# Altium schematic sheet LED.SchDoc
size A; SheetNumber: 10
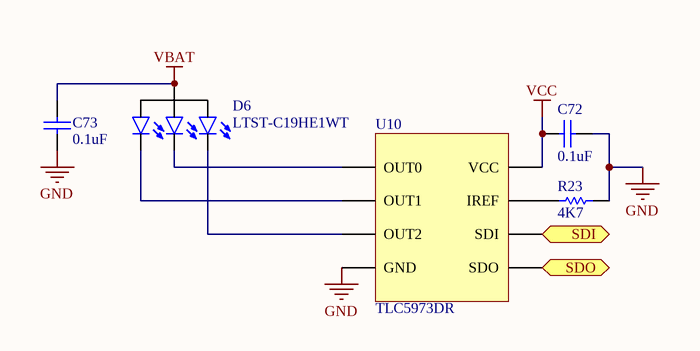
[diagram p0: LED.SchDoc]

## Parts
C72  value 0.1uF  [C0402[1005X55]]  (hidden comment: 0.1uF 6.3V 0402)
C73  value 0.1uF  [C0402[1005X55]]  (hidden comment: 0.1uF 6.3V 0402)
D6  LTST-C19HE1WT  [LED0606]
R23  value 4K7  [R0402[1005]]  (hidden comment: 4K7 1% 0402)
U10  TLC5973DR  [SOIC-8]

## Ports
SDI (in), SDO (out)

## Nets
GND: C72.2 C73.1 R23.1 U10.4(GND)
VBAT: C73.2 D6.4(A)
VCC: C72.1 U10.8(VCC)
SDI: U10.6(SDI) ; port SDI
SDO: U10.5(SDO) ; port SDO
NetD6_1: D6.1(K_Red) U10.3(OUT2)
NetD6_2: D6.2(K_Green) U10.1(OUT0)
NetD6_3: D6.3(K_Blue) U10.2(OUT1)
NetR23_2: R23.2 U10.7(IREF)

## Library data of the parts
C72 C73 = CAP_0.1uF_6.3V_0402_10%: 0.1uF 6.3V 10% 0402 (1005 Metric); PartNumber: GRM155R70J104KA01D; Manufacturer: Murata; Mounting Technology: Surface Mount; PackageReference: 0402; PackageDescription: 0402 (1005 Metric); Voltage: 6.3V; Tolerance: 10%
D6 = LTST-C19HE1WT: Manufacturer: Lite-On Inc.; PartNumber: LTST-C19HE1WT; PackageReference: 0606; Mounting Technology: Surface Mount; PackageDescription: 0606 (1616 Metric)
R23 = RES_4K7_0402_1%: 4K7 0.063W 1% 0402 (1005 Metric); Manufacturer: KOA Speer; PartNumber: RK73H1ETTP4701F; Tolerance: 1%; Power: 0.063W; Mounting Technology: Surface Mount; PackageReference: 0402; PackageDescription: 0402 (1005 Metric); ComponentLink1Description: Datasheet; ComponentLink1URL: http://www.koaspeer.com/catimages/Products/RK73H/RK73H.pdf
U10 = TLC5973DR: LED Lighting Drivers 3Ch 12B PWM Constant Crnt LED Dvr; Manufacturer: Texas Instruments; PartNumber: TLC5973DR; Mounting Technology: Surface Mount; PackageReference: SOIC-8